# EasyEDA schematic SCH_slime-vr.json

## Sheets
1 SlimeVR_Core_SCH: TITLE: SlimeVR_Core_SCH; REV: 1.2; Date: 2022-07-14; Sheet: 1/1; Drawn By: 复合体; Company: D9Lab
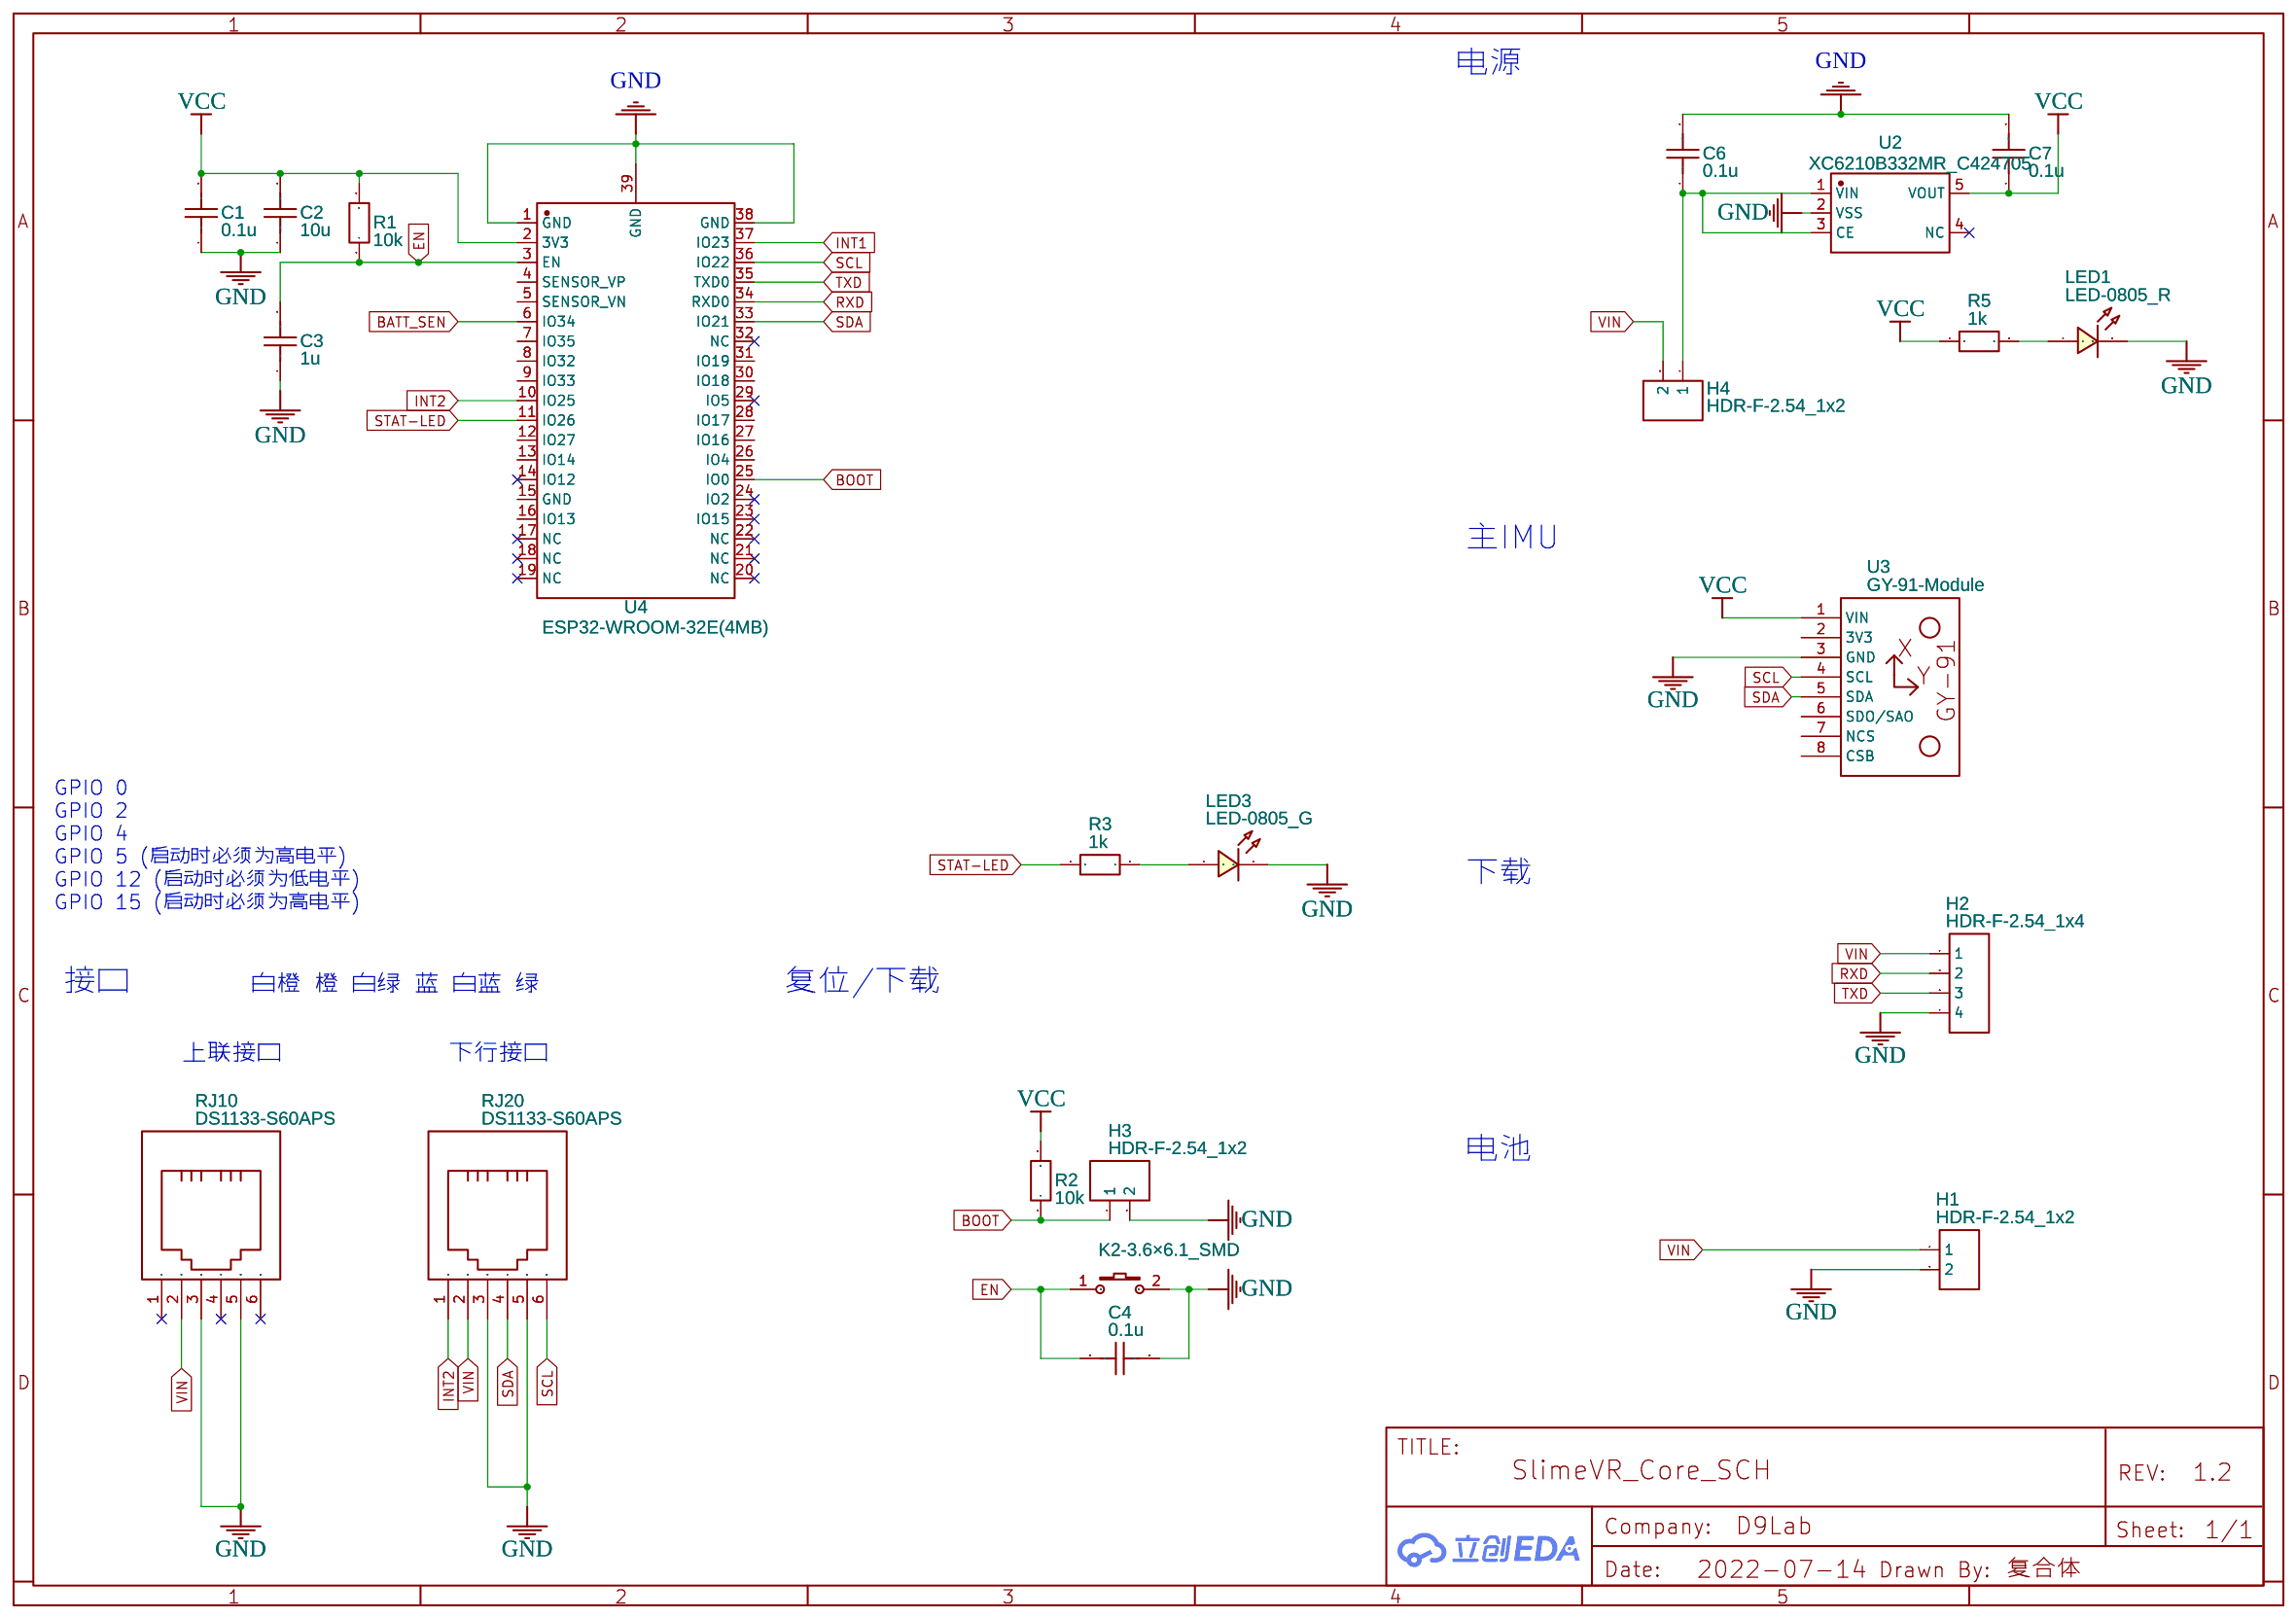
[diagram p0: SlimeVR_Core_SCH]
2 SlimeVR-AUX_SCH: TITLE: SlimeVR-AUX_SCH
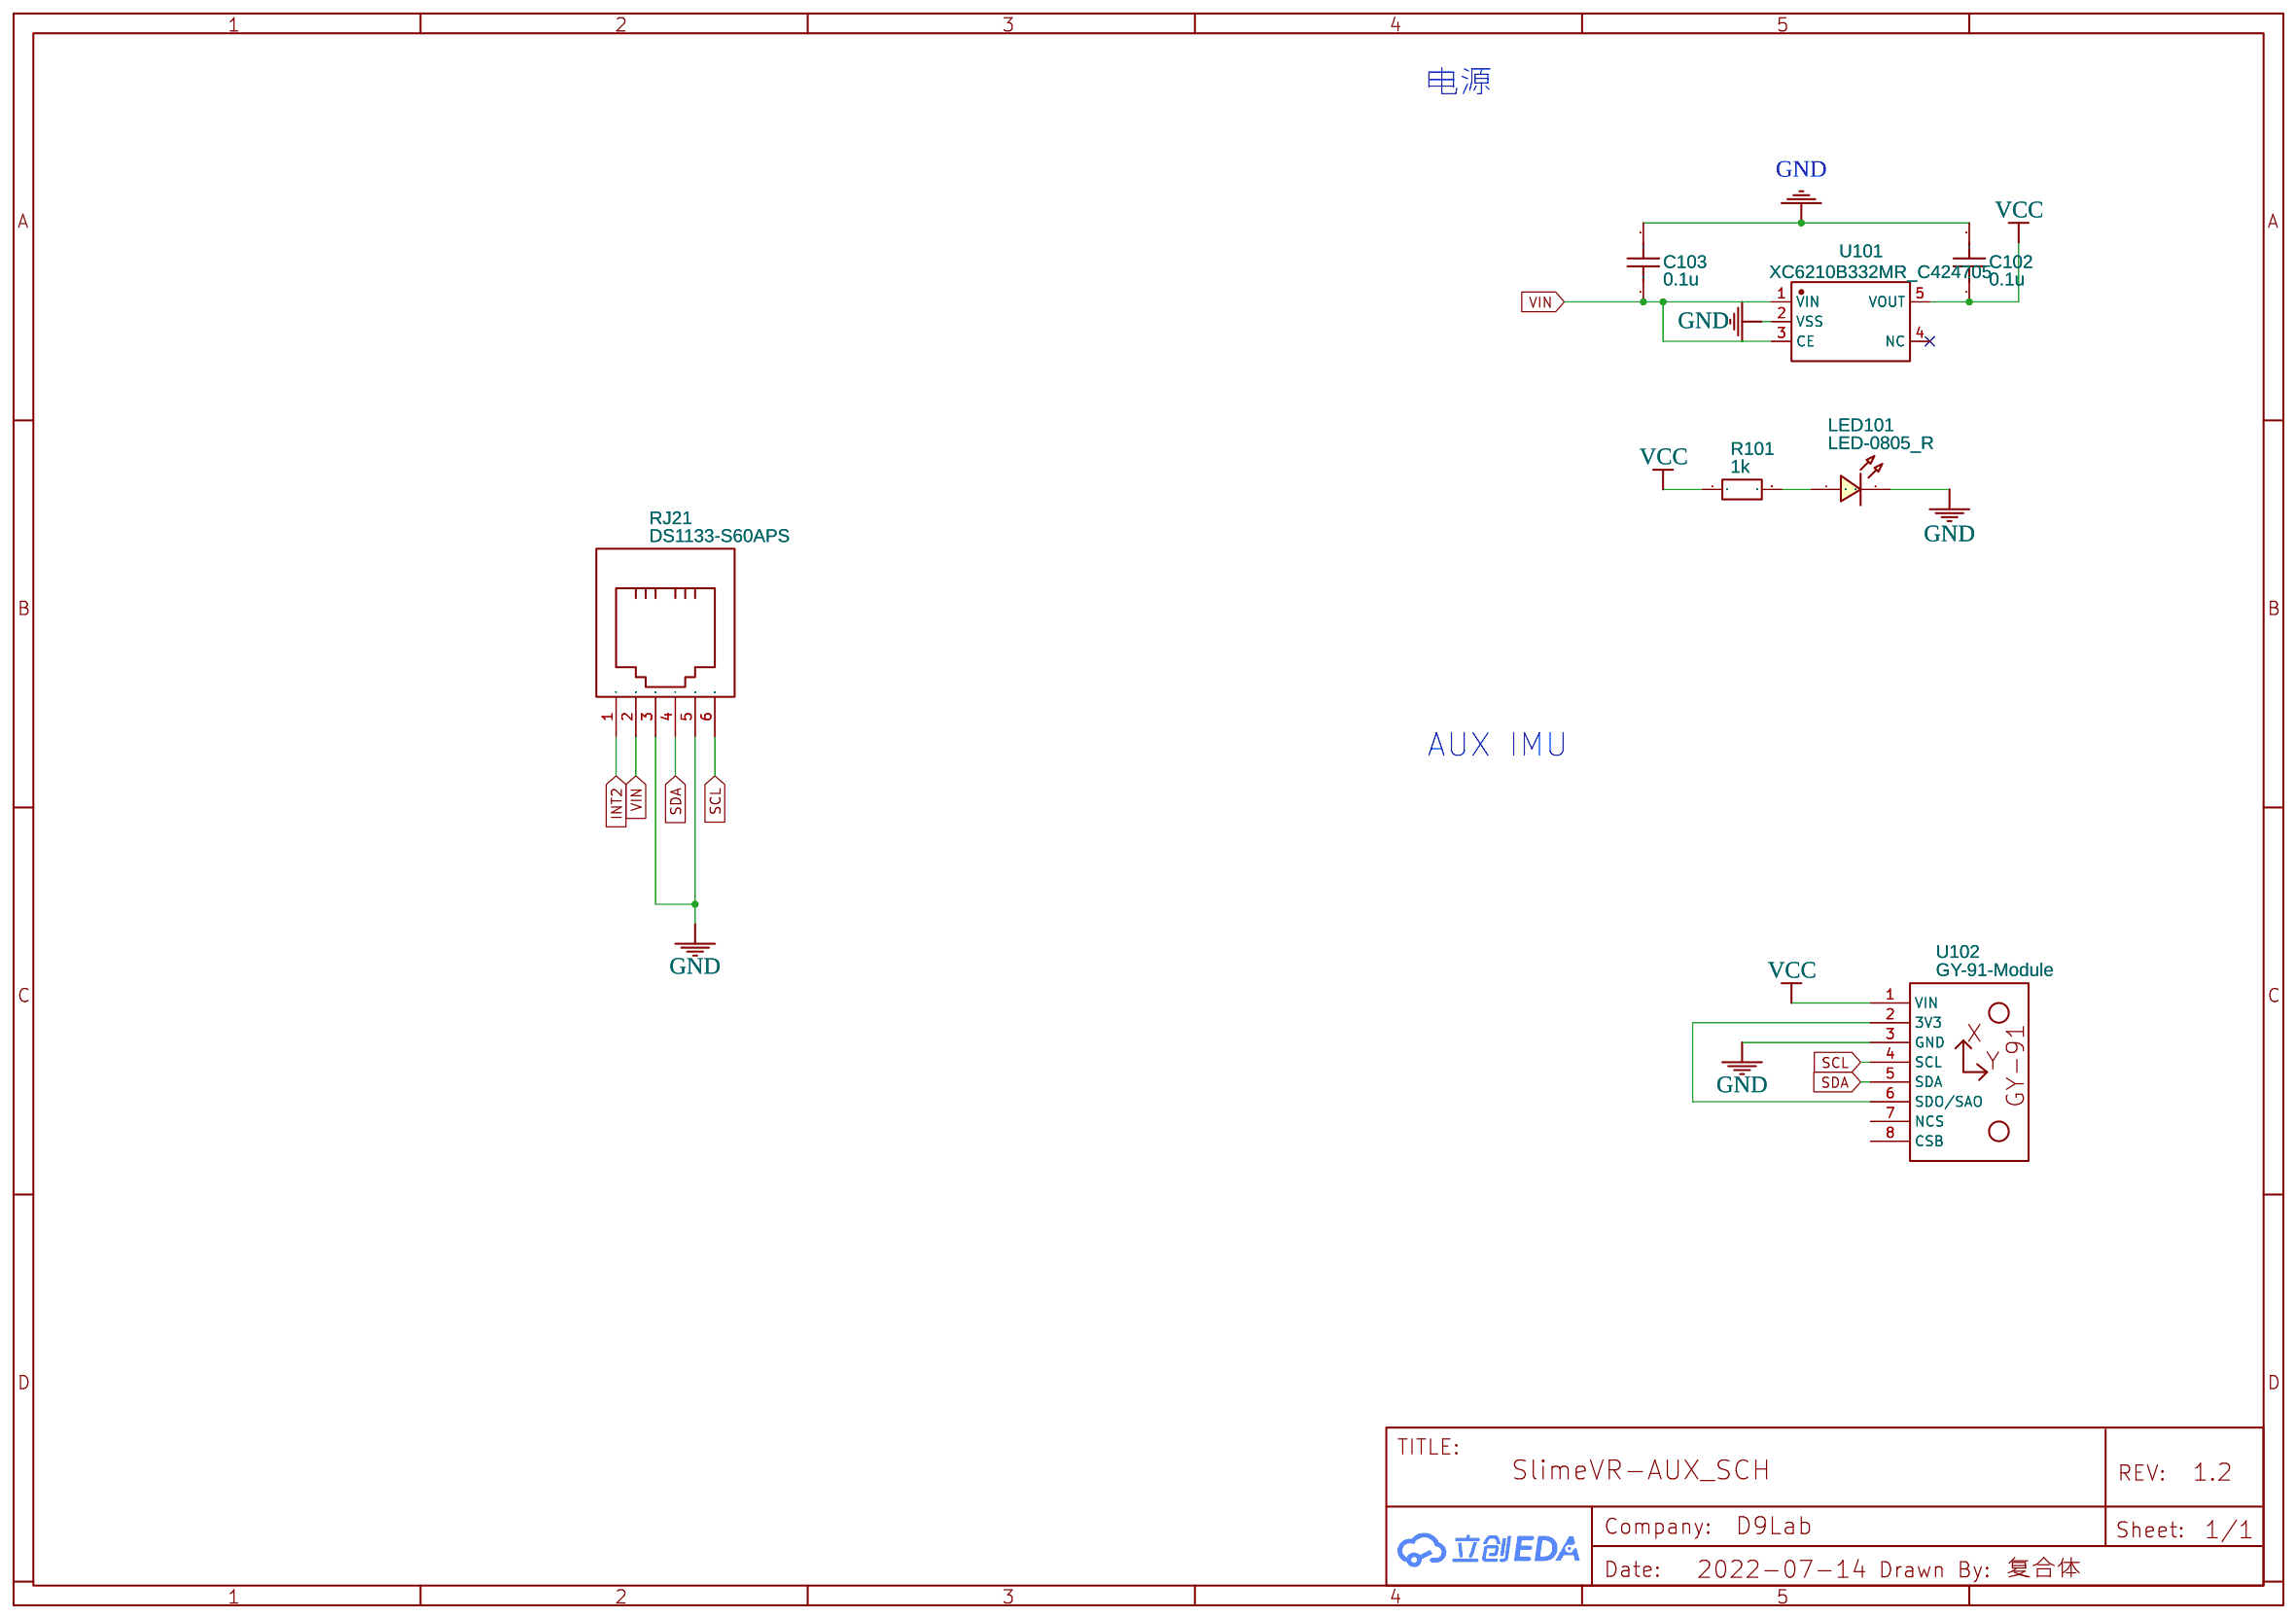
[diagram p1: SlimeVR-AUX_SCH]

## Parts
sheet SlimeVR-AUX_SCH
C102  0.1u  [C0805]
C103  0.1u  [C0805]
LED101  LED-0805_R  [LED0805_RED]
R101  1k  [R0805]
RJ21  DS1133-S60APS  [RJ11-TH_PCB-6P6C-90]
U101  XC6210B332MR_C424705  [SOT-25_L3.0-W1.6-P0.95-LS2.8-BL]
U102  GY-91-Module  [GY-91_仅排针]
sheet SlimeVR_Core_SCH
C1  0.1u  [C0805]
C2  10u  [C0805]
C3  1u  [C0805]
C4  0.1u  [C0805]
C6  0.1u  [C0805]
C7  0.1u  [C0805]
EN  K2-3.6×6.1_SMD  [KEY-SMD_2P-L6.2-W3.6-LS8.0]
H1  HDR-F-2.54_1x2  [HDR-F-2.54_1X2]
H2  HDR-F-2.54_1x4  [HDR-F-2.54_1X4]
H3  HDR-F-2.54_1x2  [HDR-F-2.54_1X2]
H4  HDR-F-2.54_1x2  [HDR-F-2.54_1X2]
LED1  LED-0805_R  [LED0805_RED]
LED3  LED-0805_G  [LED0805_GREEN]
R1  10k  [R0805]
R2  10k  [R0805]
R3  1k  [R0805]
R5  1k  [R0805]
RJ10  DS1133-S60APS  [RJ11-TH_PCB-6P6C-90]
RJ20  DS1133-S60APS  [RJ11-TH_PCB-6P6C-90]
U2  XC6210B332MR_C424705  [SOT-25_L3.0-W1.6-P0.95-LS2.8-BL]
U3  GY-91-Module  [GY-91_仅排针]
U4  ESP32-WROOM-32E(4MB)  [WIFI-SMD_ESP32-WROOM-32E]

## Library data of the parts
C1-C4 C6 C7 C102 C103 = C_0805_US: Contributor: LCEDA_Lib
LED1 LED101 = LED-0805_R: Manufacturer: EVERLIGHT(台湾亿光); Manufacturer Part: 17-21SURC/S530-A3/TR8; Supplier Part: C72037; Contributor: LCEDA_Lib
R1-R3 R5 R101 = R_0805_EU: Contributor: LCEDA_Lib
RJ10 RJ20 RJ21 = DS1133-S60APS: Supplier: LCSC; Manufacturer: CONNFLY; Contributor: LCSC; Supplier Part: C77857; JLCPCB Part Class: Extended Part
U2 U101 = XC6210B332MR_C424705: Supplier: LCSC; Supplier Part: C424705; Manufacturer: Torex Semicon; Manufacturer Part: XC6210B332MR; Contributor: LCSC; JLCPCB Part Class: Extended Part
U3 U102 = GY-91-Module: Manufacturer Part: GY-91 MPU9250 + BMP280; link: https://www.banggood.com/GY-91-MPU9250-BMP280-10DOF-Acceleration-Gyroscope-Compass-Nine-Shaft-Sensor-Module-p-1129541.html?cur_warehouse=CN; Contributor: ZhangRiven; Supplier Part: https://www.banggood.com/GY-91-MPU9250-BMP280-10DOF-Acceleration-Gyroscope-Compass-Nine-Shaft-Sensor-Module-p-1129541.html?cur_warehouse=CN; Supplier: Banggood
EN = K2-3.6×6.1_SMD: Supplier Part: C118141; Supplier: LCSC; Manufacturer Part: K2-1107ST-A4SW-06; Contributor: LCEDA_Lib; 制造商: 韩国韩荣
H1 H3 H4 = HDR-F-2.54_1x2: Supplier Part: C49661; Supplier: LCSC; Contributor: LCEDA_Lib
H2 = HDR-F-2.54_1x4: Supplier Part: C225501; Supplier: LCSC; Contributor: LCEDA_Lib
LED3 = LED-0805_G: Manufacturer: 国星光电; Manufacturer Part: NCD0805G1; Supplier Part: C84260; Contributor: LCEDA_Lib
U4 = ESP32-WROOM-32E(4MB): Supplier: LCSC; Supplier Part: C701341; Manufacturer: Espressif Systems; Contributor: LCSC; JLCPCB Part Class: Extended Part

## Nets
GND: C1.1 C2.1 C3.1 C4.1 C6.2 C7.2 C102.2 C103.2 EN.2 H1.2 H2.4 H3.2 LED1.2 LED3.2 LED101.2 RJ10.3 RJ10.5 RJ20.3 RJ20.5 RJ21.3 RJ21.5 U2.2(VSS) U3.3(GND) U4.1(GND) U4.38(GND) U4.39(GND) U101.2(VSS) U102.3(GND)
VCC: C1.2 C2.2 C7.1 C102.1 R1.2 R2.2 R5.1 R101.1 U2.5(VOUT) U3.1(VIN) U4.2(3V3) U101.5(VOUT) U102.1(VIN)
VIN: C103.1 H1.1 H2.1 H4.2 RJ10.2 RJ20.2 RJ21.2 U101.1(VIN) U101.3(CE)
BATT_SEN: U4.6(IO34)
BOOT: H3.1 R2.1 U4.25(IO0)
EN: C3.2 C4.2 EN.1 R1.1 U4.3(EN)
INT1: U4.37(IO23)
INT2: RJ20.1 RJ21.1 U4.10(IO25)
RXD: H2.2 U4.34(RXD0)
SCL: RJ20.6 RJ21.6 U3.4(SCL) U4.36(IO22) U102.4(SCL)
SDA: RJ20.4 RJ21.4 U3.5(SDA) U4.33(IO21) U102.5(SDA)
STAT-LED: R3.1 U4.11(IO26)
TXD: H2.3 U4.35(TXD0)
Net-(C6-1): C6.1 H4.1 U2.1(VIN) U2.3(CE)
Net-(LED1-1): LED1.1 R5.2
Net-(LED3-1): LED3.1 R3.2
Net-(LED101-1): LED101.1 R101.2
Net-(U102-2): U102.2(3V3) U102.6(SDO/SAO)

Not connected (* = marked no-connect by the designer): RJ10 1* 4* 6*; U2 4(NC)*; U3 2(3V3) 6(SDO/SAO) 7(NCS) 8(CSB); U4 4(SENSOR_VP) 5(SENSOR_VN) 7(IO35) 8(IO32) 9(IO33) 12(IO27) 13(IO14) 14(IO12)* 15(GND) 16(IO13) 17(NC)* 18(NC)* 19(NC)* 20(NC)* 21(NC)* 22(NC)* 23(IO15)* 24(IO2)* 26(IO4) 27(IO16) 28(IO17) 29(IO5)* 30(IO18) 31(IO19) 32(NC)*; U101 4(NC)*; U102 7(NCS) 8(CSB)

## Notes on the sheets
sheet 1
- 电源
- 主IMU
- GPIO 0
  GPIO 2
  GPIO 4
  GPIO 5 (启动时必须为高电平)
  GPIO 12 (启动时必须为低电平)
  GPIO 15 (启动时必须为高电平)
- 下载
- 接口
- 白橙 橙 白绿 蓝 白蓝 绿
- 复位/下载
- 上联接口
- 下行接口
- 电池
sheet 2
- 电源
- AUX IMU
